# Altium project B1653P01.PrjPCB
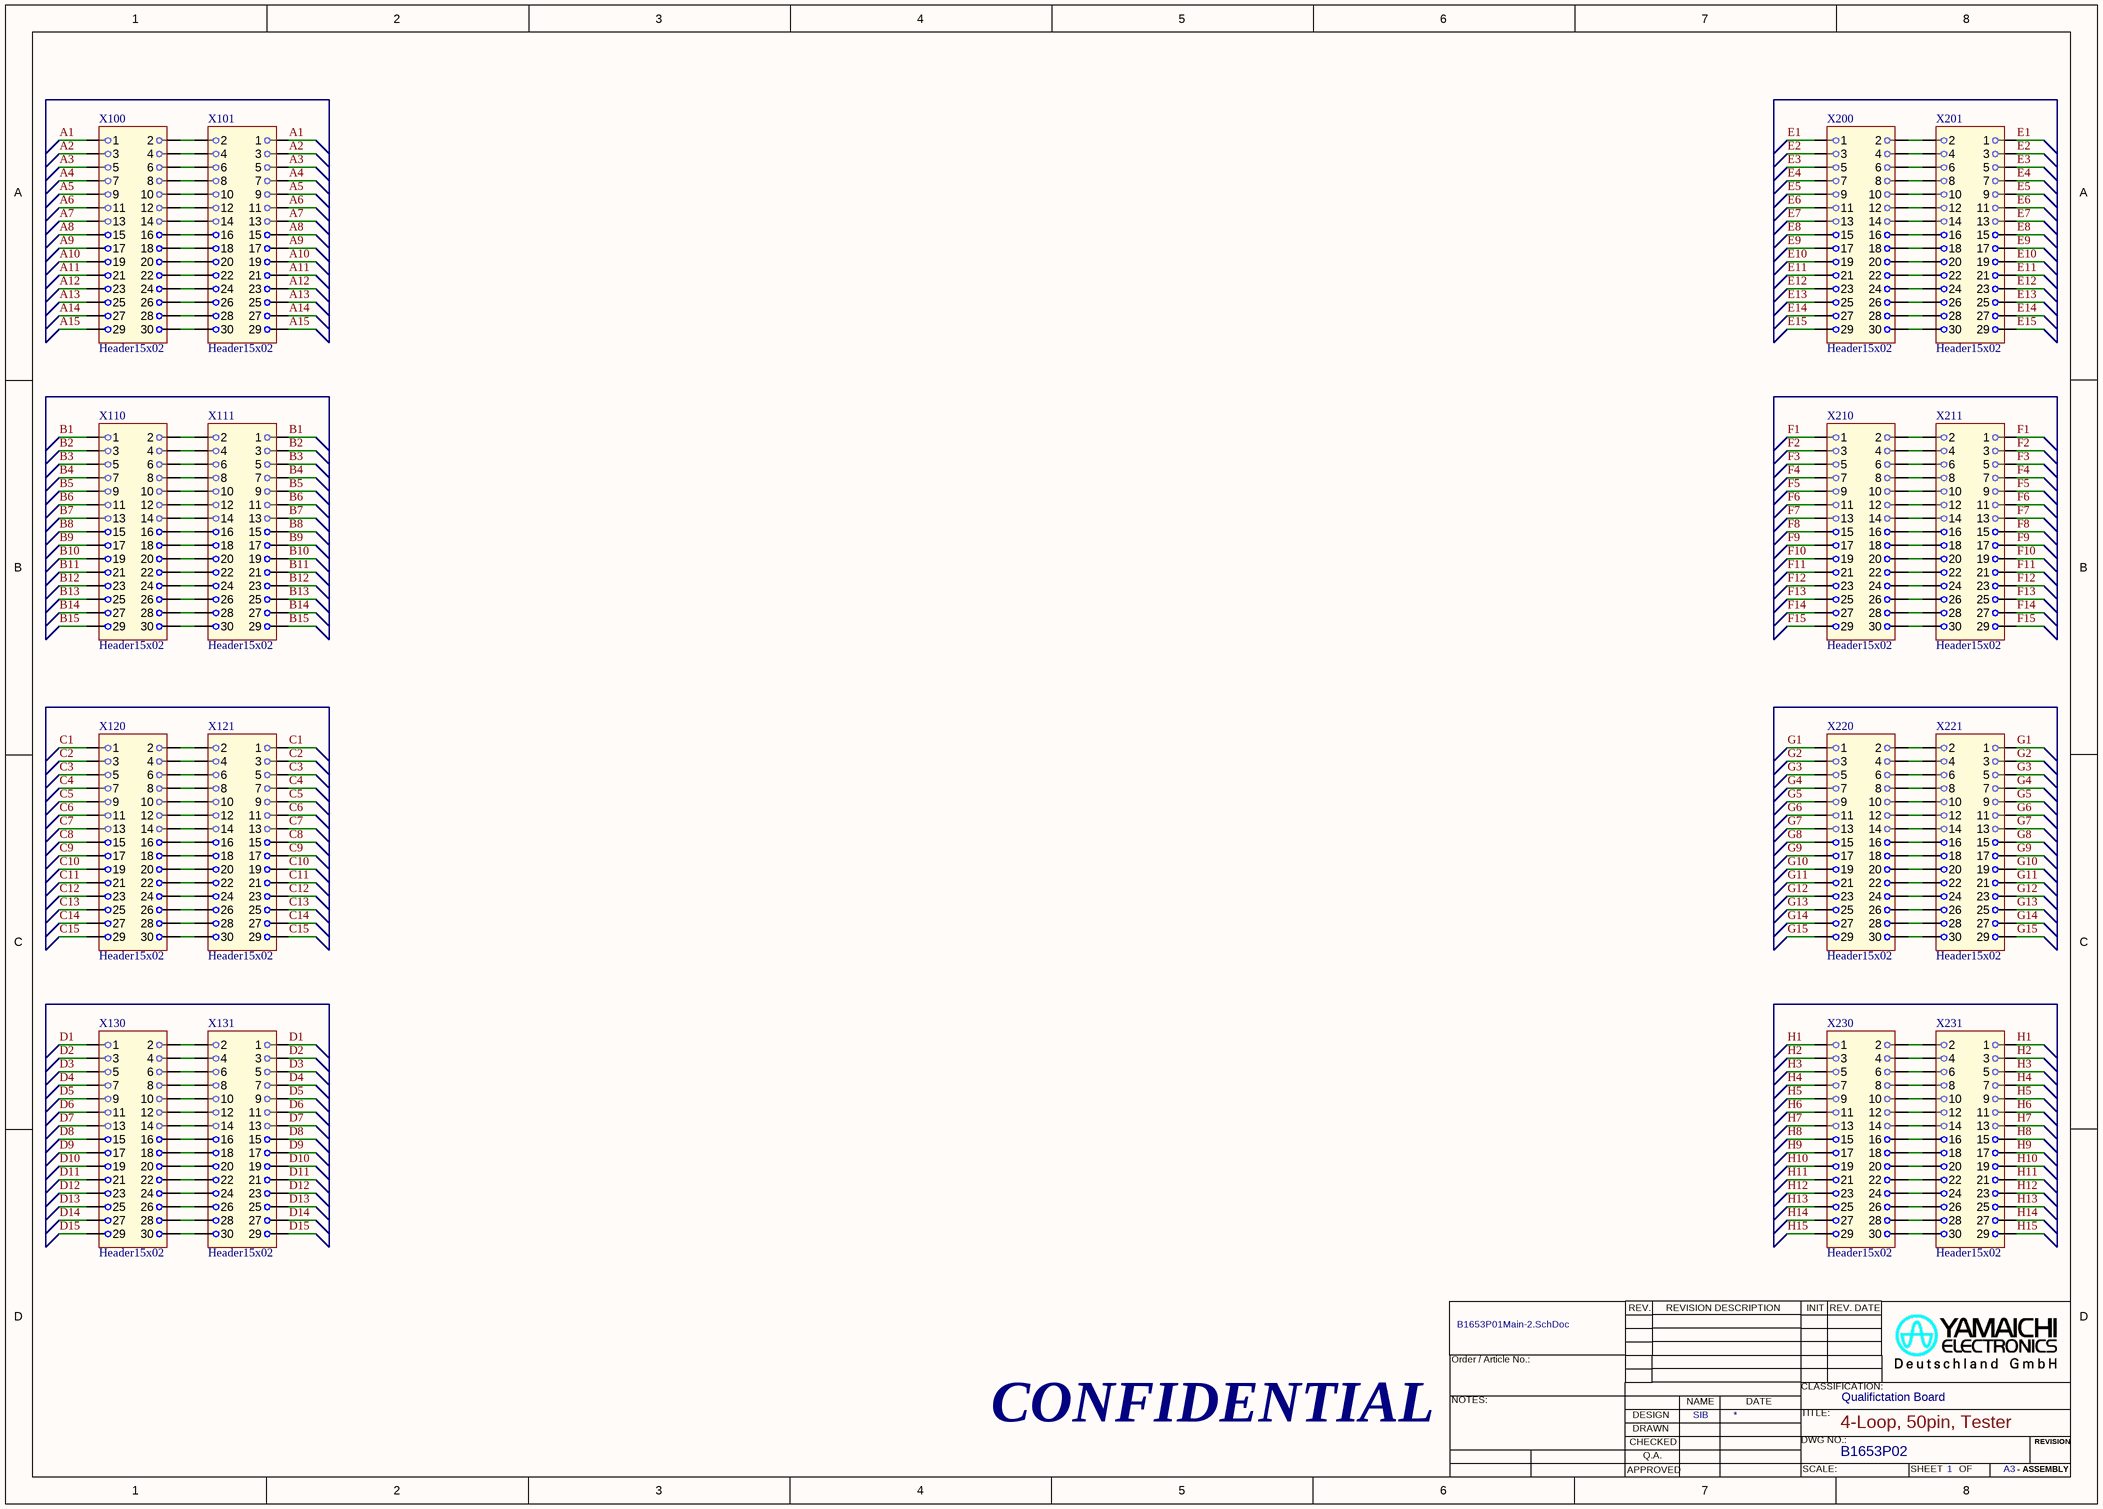
[diagram p0: B1653P01Main-2.SchDoc]
1 sheet, 16 parts. Net scope: flat (ports and power ports of the same name join across sheets).
Board file: B1653P01.PcbDoc

## Sheet B1653P01Main-2.SchDoc: 4-Loop, 50pin, Tester
size A3; SheetNumber: 1; Classification: Qualifictation Board; DrawingNumber: B1653P02; Design: SIB; PageSetup: Record=PageOptions|CenterHorizontal=True|CenterVertical=True|PrintScale=1.01|XCorrection=1.00|YCorrection=1.00|PrintKind=1|BorderSize=5000000|LeftOffset=0|BottomOffset=0|Orientation=2|PaperLength=1000|PaperWidth=1000|Scale=100|PaperSource=7|PrintQuality=600|MediaType=1|DitherType=10|PaperKind=A3 (297 x 420 mm)|PrintScaleMode=1

### Parts
X100  Header15x02  [HEADER15x02_thru]
X101  Header15x02  [HEADER15x02_thru]
X110  Header15x02  [HEADER15x02_thru]
X111  Header15x02  [HEADER15x02_thru]
X120  Header15x02  [HEADER15x02_thru]
X121  Header15x02  [HEADER15x02_thru]
X130  Header15x02  [HEADER15x02_thru]
X131  Header15x02  [HEADER15x02_thru]
X200  Header15x02  [HEADER15x02_thru]
X201  Header15x02  [HEADER15x02_thru]
X210  Header15x02  [HEADER15x02_thru]
X211  Header15x02  [HEADER15x02_thru]
X220  Header15x02  [HEADER15x02_thru]
X221  Header15x02  [HEADER15x02_thru]
X230  Header15x02  [HEADER15x02_thru]
X231  Header15x02  [HEADER15x02_thru]

### Nets
A1: X100.1 X101.1
A2: X100.3 X101.3
A3: X100.5 X101.5
A4: X100.7 X101.7
A5: X100.9 X101.9
A6: X100.11 X101.11
A7: X100.13 X101.13
A8: X100.15 X101.15
A9: X100.17 X101.17
A10: X100.19 X101.19
A11: X100.21 X101.21
A12: X100.23 X101.23
A13: X100.25 X101.25
A14: X100.27 X101.27
A15: X100.29 X101.29
B1: X110.1 X111.1
B2: X110.3 X111.3
B3: X110.5 X111.5
B4: X110.7 X111.7
B5: X110.9 X111.9
B6: X110.11 X111.11
B7: X110.13 X111.13
B8: X110.15 X111.15
B9: X110.17 X111.17
B10: X110.19 X111.19
B11: X110.21 X111.21
B12: X110.23 X111.23
B13: X110.25 X111.25
B14: X110.27 X111.27
B15: X110.29 X111.29
C1: X120.1 X121.1
C2: X120.3 X121.3
C3: X120.5 X121.5
C4: X120.7 X121.7
C5: X120.9 X121.9
C6: X120.11 X121.11
C7: X120.13 X121.13
C8: X120.15 X121.15
C9: X120.17 X121.17
C10: X120.19 X121.19
C11: X120.21 X121.21
C12: X120.23 X121.23
C13: X120.25 X121.25
C14: X120.27 X121.27
C15: X120.29 X121.29
D1: X130.1 X131.1
D2: X130.3 X131.3
D3: X130.5 X131.5
D4: X130.7 X131.7
D5: X130.9 X131.9
D6: X130.11 X131.11
D7: X130.13 X131.13
D8: X130.15 X131.15
D9: X130.17 X131.17
D10: X130.19 X131.19
D11: X130.21 X131.21
D12: X130.23 X131.23
D13: X130.25 X131.25
D14: X130.27 X131.27
D15: X130.29 X131.29
E1: X200.1 X201.1
E2: X200.3 X201.3
E3: X200.5 X201.5
E4: X200.7 X201.7
E5: X200.9 X201.9
E6: X200.11 X201.11
E7: X200.13 X201.13
E8: X200.15 X201.15
E9: X200.17 X201.17
E10: X200.19 X201.19
E11: X200.21 X201.21
E12: X200.23 X201.23
E13: X200.25 X201.25
E14: X200.27 X201.27
E15: X200.29 X201.29
F1: X210.1 X211.1
F2: X210.3 X211.3
F3: X210.5 X211.5
F4: X210.7 X211.7
F5: X210.9 X211.9
F6: X210.11 X211.11
F7: X210.13 X211.13
F8: X210.15 X211.15
F9: X210.17 X211.17
F10: X210.19 X211.19
F11: X210.21 X211.21
F12: X210.23 X211.23
F13: X210.25 X211.25
F14: X210.27 X211.27
F15: X210.29 X211.29
G1: X220.1 X221.1
G2: X220.3 X221.3
G3: X220.5 X221.5
G4: X220.7 X221.7
G5: X220.9 X221.9
G6: X220.11 X221.11
G7: X220.13 X221.13
G8: X220.15 X221.15
G9: X220.17 X221.17
G10: X220.19 X221.19
G11: X220.21 X221.21
G12: X220.23 X221.23
G13: X220.25 X221.25
G14: X220.27 X221.27
G15: X220.29 X221.29
H1: X230.1 X231.1
H2: X230.3 X231.3
H3: X230.5 X231.5
H4: X230.7 X231.7
H5: X230.9 X231.9
H6: X230.11 X231.11
H7: X230.13 X231.13
H8: X230.15 X231.15
H9: X230.17 X231.17
H10: X230.19 X231.19
H11: X230.21 X231.21
H12: X230.23 X231.23
H13: X230.25 X231.25
H14: X230.27 X231.27
H15: X230.29 X231.29
NetX100_2: X100.2 X101.2
NetX100_4: X100.4 X101.4
NetX100_6: X100.6 X101.6
NetX100_8: X100.8 X101.8
NetX100_10: X100.10 X101.10
NetX100_12: X100.12 X101.12
NetX100_14: X100.14 X101.14
NetX100_16: X100.16 X101.16
NetX100_18: X100.18 X101.18
NetX100_20: X100.20 X101.20
NetX100_22: X100.22 X101.22
NetX100_24: X100.24 X101.24
NetX100_26: X100.26 X101.26
NetX100_28: X100.28 X101.28
NetX100_30: X100.30 X101.30
NetX110_2: X110.2 X111.2
NetX110_4: X110.4 X111.4
NetX110_6: X110.6 X111.6
NetX110_8: X110.8 X111.8
NetX110_10: X110.10 X111.10
NetX110_12: X110.12 X111.12
NetX110_14: X110.14 X111.14
NetX110_16: X110.16 X111.16
NetX110_18: X110.18 X111.18
NetX110_20: X110.20 X111.20
NetX110_22: X110.22 X111.22
NetX110_24: X110.24 X111.24
NetX110_26: X110.26 X111.26
NetX110_28: X110.28 X111.28
NetX110_30: X110.30 X111.30
NetX120_2: X120.2 X121.2
NetX120_4: X120.4 X121.4
NetX120_6: X120.6 X121.6
NetX120_8: X120.8 X121.8
NetX120_10: X120.10 X121.10
NetX120_12: X120.12 X121.12
NetX120_14: X120.14 X121.14
NetX120_16: X120.16 X121.16
NetX120_18: X120.18 X121.18
NetX120_20: X120.20 X121.20
NetX120_22: X120.22 X121.22
NetX120_24: X120.24 X121.24
NetX120_26: X120.26 X121.26
NetX120_28: X120.28 X121.28
NetX120_30: X120.30 X121.30
NetX130_2: X130.2 X131.2
NetX130_4: X130.4 X131.4
NetX130_6: X130.6 X131.6
NetX130_8: X130.8 X131.8
NetX130_10: X130.10 X131.10
NetX130_12: X130.12 X131.12
NetX130_14: X130.14 X131.14
NetX130_16: X130.16 X131.16
NetX130_18: X130.18 X131.18
NetX130_20: X130.20 X131.20
NetX130_22: X130.22 X131.22
NetX130_24: X130.24 X131.24
NetX130_26: X130.26 X131.26
NetX130_28: X130.28 X131.28
NetX130_30: X130.30 X131.30
NetX200_2: X200.2 X201.2
NetX200_4: X200.4 X201.4
NetX200_6: X200.6 X201.6
NetX200_8: X200.8 X201.8
NetX200_10: X200.10 X201.10
NetX200_12: X200.12 X201.12
NetX200_14: X200.14 X201.14
NetX200_16: X200.16 X201.16
NetX200_18: X200.18 X201.18
NetX200_20: X200.20 X201.20
NetX200_22: X200.22 X201.22
NetX200_24: X200.24 X201.24
NetX200_26: X200.26 X201.26
NetX200_28: X200.28 X201.28
NetX200_30: X200.30 X201.30
NetX210_2: X210.2 X211.2
NetX210_4: X210.4 X211.4
NetX210_6: X210.6 X211.6
NetX210_8: X210.8 X211.8
NetX210_10: X210.10 X211.10
NetX210_12: X210.12 X211.12
NetX210_14: X210.14 X211.14
NetX210_16: X210.16 X211.16
NetX210_18: X210.18 X211.18
NetX210_20: X210.20 X211.20
NetX210_22: X210.22 X211.22
NetX210_24: X210.24 X211.24
NetX210_26: X210.26 X211.26
NetX210_28: X210.28 X211.28
NetX210_30: X210.30 X211.30
NetX220_2: X220.2 X221.2
NetX220_4: X220.4 X221.4
NetX220_6: X220.6 X221.6
NetX220_8: X220.8 X221.8
NetX220_10: X220.10 X221.10
NetX220_12: X220.12 X221.12
NetX220_14: X220.14 X221.14
NetX220_16: X220.16 X221.16
NetX220_18: X220.18 X221.18
NetX220_20: X220.20 X221.20
NetX220_22: X220.22 X221.22
NetX220_24: X220.24 X221.24
NetX220_26: X220.26 X221.26
NetX220_28: X220.28 X221.28
NetX220_30: X220.30 X221.30
NetX230_2: X230.2 X231.2
NetX230_4: X230.4 X231.4
NetX230_6: X230.6 X231.6
NetX230_8: X230.8 X231.8
NetX230_10: X230.10 X231.10
NetX230_12: X230.12 X231.12
NetX230_14: X230.14 X231.14
NetX230_16: X230.16 X231.16
NetX230_18: X230.18 X231.18
NetX230_20: X230.20 X231.20
NetX230_22: X230.22 X231.22
NetX230_24: X230.24 X231.24
NetX230_26: X230.26 X231.26
NetX230_28: X230.28 X231.28
NetX230_30: X230.30 X231.30

### Notes on the sheet
- REV.
- REVISION DESCRIPTION
- INIT
- REV. DATE
- Order / Article No.:
- CLASSIFICATION:
- CONFIDENTIAL
- NOTES:
- CHECKED
- DESIGN
- DRAWN
- Q.A.
- NAME
- DATE
- TITLE:
- DWG NO.:
- REVISION
- APPROVED
- SCALE:
- SHEET
- OF
- A3
- - ASSEMBLY

### Library data of the parts
X100 X101 X110 X111 X120 X121 X130 X131 X200 X201 X210 X211 X220 X221 X230 X231 = X000027: Header15x02 thru; ComponentLink1Description: Local-Datasheet; ComponentLink2Description: Online-Component-Link; Type: Header15x02; Part Number: X000027; ComponentLink1URL: S:\Engineering\PCB_Design_Department\AltiumDesigner\Library\Datasheet\X\Headerleisten_AMPMODUL2.pdf; Pin Count: 30